# Altium schematic sheet connector.SchDoc
size A4
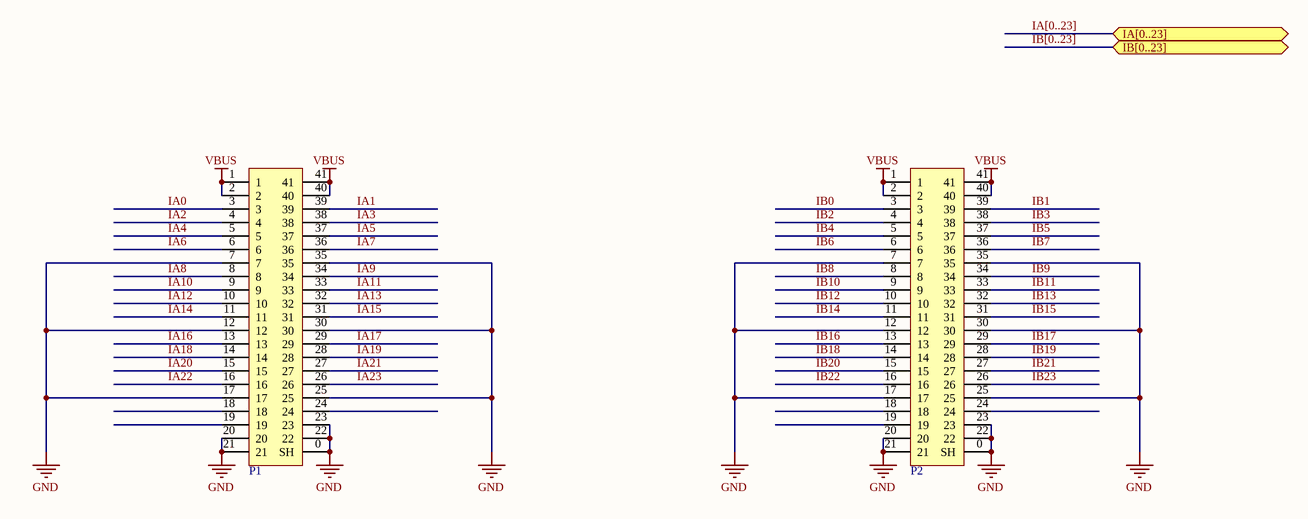
[diagram p0: connector.SchDoc]

## Parts
P1  DF9-41S  [DF9-41S]  (value not drawn)
P2  DF9-41S  [DF9-41S]  (value not drawn)

## Ports
IA[0..23], IB[0..23]

## Nets
GND: P1.0(SH) P1.7 P1.12 P1.17 P1.20 P1.21 P1.22 P1.23 P1.25 P1.30 P1.35 P2.0(SH) P2.7 P2.12 P2.17 P2.20 P2.21 P2.22 P2.23 P2.25 P2.30 P2.35
VBUS: P1.1 P1.2 P1.40 P1.41 P2.1 P2.2 P2.40 P2.41
IA0: P1.3
IA1: P1.39
IA2: P1.4
IA3: P1.38
IA4: P1.5
IA5: P1.37
IA6: P1.6
IA7: P1.36
IA8: P1.8
IA9: P1.34
IA10: P1.9
IA11: P1.33
IA12: P1.10
IA13: P1.32
IA14: P1.11
IA15: P1.31
IA16: P1.13
IA17: P1.29
IA18: P1.14
IA19: P1.28
IA20: P1.15
IA21: P1.27
IA22: P1.16
IA23: P1.26
IB0: P2.3
IB1: P2.39
IB2: P2.4
IB3: P2.38
IB4: P2.5
IB5: P2.37
IB6: P2.6
IB7: P2.36
IB8: P2.8
IB9: P2.34
IB10: P2.9
IB11: P2.33
IB12: P2.10
IB13: P2.32
IB14: P2.11
IB15: P2.31
IB16: P2.13
IB17: P2.29
IB18: P2.14
IB19: P2.28
IB20: P2.15
IB21: P2.27
IB22: P2.16
IB23: P2.26

Not connected (* = marked no-connect by the designer): P1 18 19 24; P2 18 19 24

## Buses and harness runs
bus IA[0..23] = port IA[0..23]
bus IB[0..23] = port IB[0..23]